# Altium project Fast_Servo.PrjPCB (part 2 of 7)

## Sheet SOM_JB3.SchDoc: SoM TE0720 JB3
size 420 x 297 mm; Author: P. Zdunek; DrawnBy: P. Zdunek; Organization: Altium Limited; Address1: L3, 12a Rodborough Rd; Address2: Frenchs Forest; Address3: NSW; Address4: Australia 2086; DocumentNumber: 5; SheetNumber: 5; SheetTotal: 37; ModifiedBy: -; CheckedDate: -; Title2: Fast Stabilizer; DivGrp: WUT ISE; Designer: G.Kasprowicz
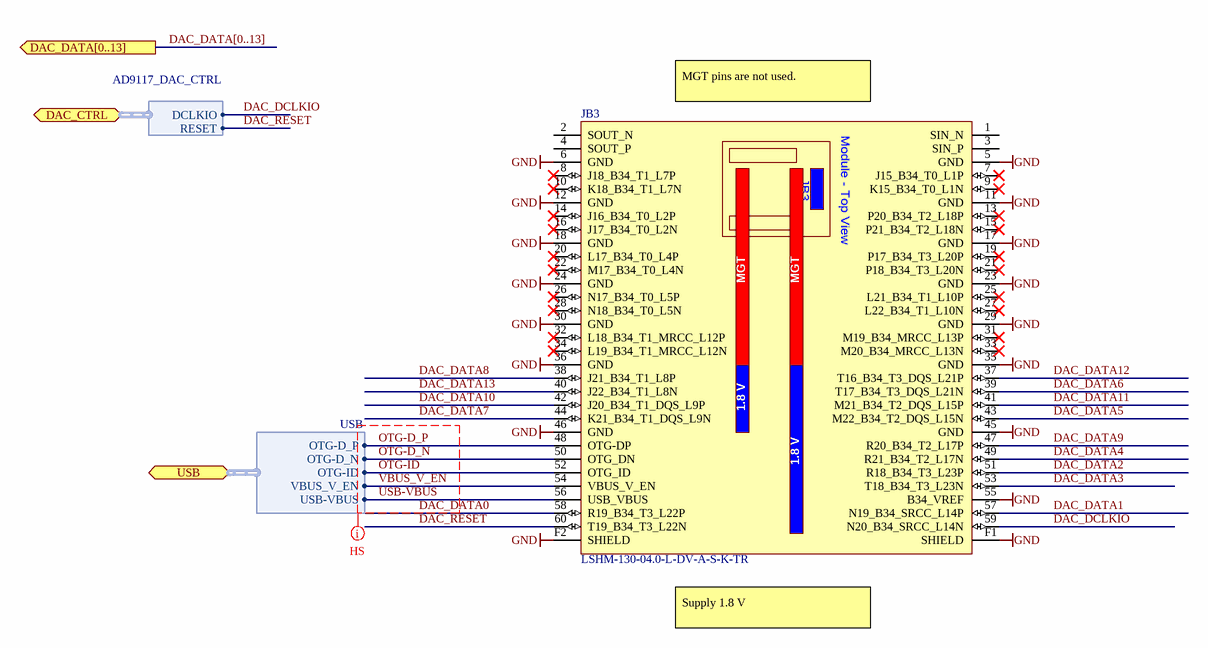
[diagram p4: SOM_JB3.SchDoc]

### Parts
JB3  LSHM-130-04.0-L-DV-A-S-K-TR  [LSHM-130-04.0-x-DV-A-S-K-TR]

### Ports
DAC_CTRL (bidir, harness AD9117_DAC_CTRL), DAC_DATA[0..13] (out), USB (bidir, harness USB)

### Harnesses
USB: USB-VBUS, VBUS_V_EN, OTG-D_P, OTG-D_N, OTG-ID
AD9117_DAC_CTRL: DCLKIO, RESET

### Nets
GND: JB3.5(GND) JB3.6(GND) JB3.11(GND) JB3.12(GND) JB3.17(GND) JB3.18(GND) JB3.23(GND) JB3.24(GND) JB3.29(GND) JB3.30(GND) JB3.35(GND) JB3.36(GND) JB3.45(GND) JB3.46(GND) JB3.55(B34_VREF) JB3.F1(SHIELD) JB3.F2(SHIELD)
DAC_DATA0: JB3.58(R19_B34_T3_L22P)
DAC_DATA1: JB3.57(N19_B34_SRCC_L14P)
DAC_DATA2: JB3.51(R18_B34_T3_L23P)
DAC_DATA3: JB3.53(T18_B34_T3_L23N)
DAC_DATA4: JB3.49(R21_B34_T2_L17N)
DAC_DATA5: JB3.43(M22_B34_T2_DQS_L15N)
DAC_DATA6: JB3.39(T17_B34_T3_DQS_L21N)
DAC_DATA7: JB3.44(K21_B34_T1_DQS_L9N)
DAC_DATA8: JB3.38(J21_B34_T1_L8P)
DAC_DATA9: JB3.47(R20_B34_T2_L17P)
DAC_DATA10: JB3.42(J20_B34_T1_DQS_L9P)
DAC_DATA11: JB3.41(M21_B34_T2_DQS_L15P)
DAC_DATA12: JB3.37(T16_B34_T3_DQS_L21P)
DAC_DATA13: JB3.40(J22_B34_T1_L8N)
DAC_DCLKIO: JB3.59(N20_B34_SRCC_L14N) ; port DAC_CTRL.DCLKIO
DAC_RESET: JB3.60(T19_B34_T3_L22N) ; port DAC_CTRL.RESET
OTG-D_N: JB3.50(OTG_DN) ; port USB.OTG-D_N
OTG-D_P: JB3.48(OTG-DP) ; port USB.OTG-D_P
OTG-ID: JB3.52(OTG_ID) ; port USB.OTG-ID
USB-VBUS: JB3.56(USB_VBUS) ; port USB.USB-VBUS
VBUS_V_EN: JB3.54(VBUS_V_EN) ; port USB.VBUS_V_EN

Not connected (* = marked no-connect by the designer): JB3 1(SIN_N) 2(SOUT_N) 3(SIN_P) 4(SOUT_P) 7(J15_B34_T0_L1P)* 8(J18_B34_T1_L7P)* 9(K15_B34_T0_L1N)* 10(K18_B34_T1_L7N)* 13(P20_B34_T2_L18P)* 14(J16_B34_T0_L2P)* 15(P21_B34_T2_L18N)* 16(J17_B34_T0_L2N)* 19(P17_B34_T3_L20P)* 20(L17_B34_T0_L4P)* 21(P18_B34_T3_L20N)* 22(M17_B34_T0_L4N)* 25(L21_B34_T1_L10P)* 26(N17_B34_T0_L5P)* 27(L22_B34_T1_L10N)* 28(N18_B34_T0_L5N)* 31(M19_B34_MRCC_L13P)* 32(L18_B34_T1_MRCC_L12P)* 33(M20_B34_MRCC_L13N)* 34(L19_B34_T1_MRCC_L12N)*

### Buses and harness runs
bus DAC_DATA[0..13] = port DAC_DATA[0..13]

### Layout directives
net class HIGH_SPEED: DAC_DATA0, OTG-D_N, OTG-D_P, OTG-ID, USB-VBUS, VBUS_V_EN

### Notes on the sheet
- (near JB3) MGT pins are not used.
- (near JB3) MGT
- (near JB3) 1.8 V
- (near JB3) Supply 1.8 V
- Project/Equipment
- Document
- Designer
- Drawn by
- Check.by
- Copyright WUT ISE 2020.
  This documentation describes Open Hardware and is licensed under the CERN OHL v.1.2. You may redistribute and modify this documentation under the terms of the CERN OHL v.1.2. (http://ohwr.org/CERNOHL). This documentation is distributed WITHOUT ANY EXPRESS OR IMPLIED WARRANTY, INCLUDING OF MERCHANTABILITY, SATISFACTORY QUALITY AND FITNESS FOR A PARTICULAR PURPOSE. Please see the CERN OHL v.1.2 for applicable conditions.
- Contact
- File
- Last Mod.
- Print Date
- Sheet
- Size
- A3
- of
- Rev
- (in symbol 25287) Module - Top View

### Library data of the parts
JB3 = 25287: Samtec Razor Beam REF-189017-02, LF-04.0, 60 Pins, für alle 4x5 SoMs; Mixed: SMT; Trenz-Stock: Yes; Trenz-Article-Number: 24903; AN: 25287; Part Number: LSHM-130-04.0-L-DV-A-S-K-TR

## Sheet LEDS.SchDoc: LEDs
size 420 x 297 mm; Author: P. Zdunek; DrawnBy: P. Zdunek; Organization: Altium Limited; Address1: L3, 12a Rodborough Rd; Address2: Frenchs Forest; Address3: NSW; Address4: Australia 2086; DocumentNumber: 15; SheetNumber: 15; SheetTotal: 37; ModifiedBy: -; CheckedDate: -; Title2: Fast Stabilizer; DivGrp: WUT ISE; Designer: G.Kasprowicz
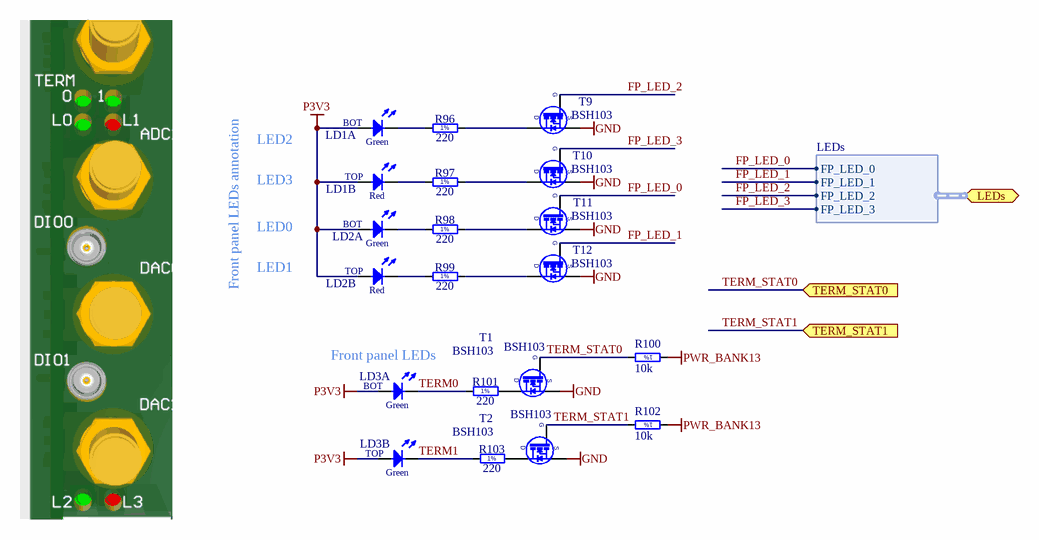
[diagram p5: LEDS.SchDoc]

### Parts
LD1  Red/Green  [LED_DIALIGHT_571-0112F]  (value not drawn)  (parts A,B of 2)
LD2  Red/Green  [LED_DIALIGHT_571-0112F]  (value not drawn)  (parts A,B of 2)
LD3  Green/Green  [LED_DIALIGHT_571-0122F]  (value not drawn)  (parts A,B of 2)
R96  220  [RESC1608X55N]
R97  220  [RESC1608X55N]
R98  220  [RESC1608X55N]
R99  220  [RESC1608X55N]
R100  10k  [RESC1005X40N]
R101  220  [RESC1608X55N]
R102  10k  [RESC1005X40N]
R103  220  [RESC1608X55N]
T1  BSH103  [SOT95P230X110-3N]
T2  BSH103  [SOT95P230X110-3N]
T9  BSH103  [SOT95P230X110-3N]
T10  BSH103  [SOT95P230X110-3N]
T11  BSH103  [SOT95P230X110-3N]
T12  BSH103  [SOT95P230X110-3N]

### Ports
LEDs (bidir, harness LEDs), TERM_STAT0 (in), TERM_STAT1 (in)

### Harnesses
LEDs: FP_LED_0, FP_LED_1, FP_LED_2, FP_LED_3

### Nets
GND: T1.2(S) T2.2(S) T9.2(S) T10.2(S) T11.2(S) T12.2(S)
P3V3: LD1.2(A) LD1.4(A) LD2.2(A) LD2.4(A) LD3.2(A) LD3.4(A)
PWR_BANK13: R100.1 R102.1
FP_LED_0: T11.1(G) ; port LEDs.FP_LED_0
FP_LED_1: T12.1(G) ; port LEDs.FP_LED_1
FP_LED_2: T9.1(G) ; port LEDs.FP_LED_2
FP_LED_3: T10.1(G) ; port LEDs.FP_LED_3
TERM0: LD3.1(C) R101.1
TERM1: LD3.3(C) R103.1
TERM_STAT0: R100.2 T1.1(G) ; port TERM_STAT0
TERM_STAT1: R102.2 T2.1(G) ; port TERM_STAT1
NetLD1_1: LD1.1(C) R96.1
NetLD1_3: LD1.3(C) R97.1
NetLD2_1: LD2.1(C) R98.1
NetLD2_3: LD2.3(C) R99.1
NetR96_2: R96.2 T9.3(D)
NetR97_2: R97.2 T10.3(D)
NetR98_2: R98.2 T11.3(D)
NetR99_2: R99.2 T12.3(D)
NetR101_2: R101.2 T1.3(D)
NetR103_2: R103.2 T2.3(D)

### Notes on the sheet
- LED2
- LED3
- Front panel LEDs annotation
- LED0
- LED1
- Front panel LEDs
- Project/Equipment
- Document
- Designer
- Drawn by
- Check.by
- Copyright WUT ISE 2020.
  This documentation describes Open Hardware and is licensed under the CERN OHL v.1.2. You may redistribute and modify this documentation under the terms of the CERN OHL v.1.2. (http://ohwr.org/CERNOHL). This documentation is distributed WITHOUT ANY EXPRESS OR IMPLIED WARRANTY, INCLUDING OF MERCHANTABILITY, SATISFACTORY QUALITY AND FITNESS FOR A PARTICULAR PURPOSE. Please see the CERN OHL v.1.2 for applicable conditions.
- Contact
- File
- Last Mod.
- Print Date
- Sheet
- Size
- A3
- of
- Rev
- (in symbol LED_DIALIGHT_571-0112F, part A) BOT; Green
- (in symbol LED_DIALIGHT_571-0112F, part B) TOP; Red
- (in symbol LED_DIALIGHT_571-0122F, part A) BOT; Green
- (in symbol LED_DIALIGHT_571-0122F, part B) TOP; Green
- (in symbol R0402_10K_1%_0.0625W_100PPM) 1%
- (in symbol R0603_220R_1%_0.1W_100PPM) 1%

### Library data of the parts
LD1 LD2 = LED_DIALIGHT_571-0112F: 2x LED  Botom Green, Top Red; Part Description: Dual 2mm  LEDs, Red Top,Green Bot, CBI® Circuit Board Indicator (Without positioning pins); PressFit: No; Bonding: No; Part Number: LED_DIALIGHT_571-0112F; Component Kind: Standard; Component Type: Standard; Color: Red/Green; PackageDescription: 2x 2mm LED (Top: Red, Bot: Green) PCB Edge Mounting (Without positioning pins) DIALIGHT 571 Serie; Manufacturer: DIALIGHT; Manufacturer Part Number: 571-0112F; Pin Count: 4; Mounted: Yes; Socket: No; SMD: No; Sense: No; ComponentHeight: 8.6mm; HelpURL: \\cern.ch\dfs\Applications\Altium\Datasheets\LED_DIALIGHT_571-0112F.pdf; Author: CERN DEM JLC; CreateDate: 09/11/2009; LatestRevisionDate: 17/03/2010
LD3 = LED_DIALIGHT_571-0122F: LED x2 Green 1C2A-BOT_3C4A-TOP; Part Description: Dual 2mm Green LEDs CBI® Circuit Board Indicator (Without positioning pins); PressFit: No; Bonding: No; Part Number: LED_DIALIGHT_571-0122F; Component Kind: Standard; Component Type: Standard; Color: Green/Green; PackageDescription: 2x 2mm Red LED PCB Edge Mounting (Without positioning pins) DIALIGHT 571 Serie; Manufacturer: DIALIGHT; Manufacturer Part Number: 571-0122F; Pin Count: 4; Mounted: Yes; Socket: No; SMD: No; Sense: No; ComponentHeight: 8.6mm; HelpURL: \\cern.ch\dfs\Applications\Altium\Datasheets\LED_DIALIGHT_571-0122F.pdf; Author: CERN DEM JLC; CreateDate: 09.11.2009; LatestRevisionDate: 17.03.2010
R96-R99 R101 R103 = R0603_220R_1%_0.1W_100PPM: Resistor - 1%; Part Description: General Purpose Thick Film Chip Resistor; Manufacturer: GENERIC; Manufacturer1 Part Number: NRC06F2200TRF; Power: 0.1W; TC: ±100ppm/°C; Part Number: R0603_220R_1%_0.1W_100PPM; Component Kind: Standard; Component Type: Standard; Pin Count: 2; Value: 220; Status: Preferred; Tolerance: ±1%; Manufacturer Part Number: R0603_220R_1%_0.1W_100PPM; Case: 0603; Mounted: Yes; Sense: No; Socket: No; SMD: Yes; Manufacturer1 Example: NIC COMPONENT; Manufacturer1 ComponentHeight: 0.55mm; HelpURL: \\cern.ch\dfs\Applications\Altium\Datasheets\R0603_NIC_NRC.pdf; Author: CERN DEM JLC; CreateDate: 03.12.2007; LatestRevisionDate: 13.03.2008
R100 R102 = R0402_10K_1%_0.0625W_100PPM: Resistor - 1%; Part Description: General Purpose Thick Film Chip Resistor; Manufacturer: GENERIC; Manufacturer1 Part Number: 232270671003L; TC: ±100ppm/°C; Part Number: R0402_10K_1%_0.0625W_100PPM; Component Kind: Standard; Component Type: Standard; Pin Count: 2; Value: 10k; Status: Not recommended; Power: 0.0625W; Tolerance: ±1%; Manufacturer Part Number: R0402_10K_1%_0.0625W_100PPM; Case: 0402; Mounted: Yes; Sense: No; Socket: No; SMD: Yes; Manufacturer1 Example: YAGEO PHYCOMP; Manufacturer1 ComponentHeight: 0.4mm; HelpURL: \\cern.ch\dfs\Applications\Altium\Datasheets\R0402_Phycomp_RC0402.pdf; Author: CERN DEM JLC; CreateDate: 03.12.2007; LatestRevisionDate: 17.10.2012
T1 T2 T9-T12 = BSH103: N-CHANNEL MOSFET WITH DIODE; Part Description: 30V 850mA N-Channel Enhancement Mode Field-Effect Transistor; Manufacturer: NEXPERIA; PressFit: No; Bonding: No; Part Number: BSH103; Component Kind: Standard; Component Type: Standard; Device: BSH103; Manufacturer Part Number: BSH103; Pin Count: 3; Case: SOT23-3; Mounted: Yes; Socket: No; SMD: Yes; Sense: No; ComponentHeight: 1.1mm; HelpURL: \\cern.ch\dfs\Applications\Altium\Datasheets\BSH103.pdf; Author: CERN DEM JLC; CreateDate: 16.03.2010; LatestRevisionDate: 20.06.2017
  T1 T2: PackageDescription: SOT23, 0.95mm Pitch; 3 Pin, 1.30mm W X 2.90mm L X 1.10mm H body, IPC Medium Density
  T9-T12: PackageDescription: SOT23, 3 pin, Pitch 0.95mm - 1.3mm W X 2.9mm L X 1.1mm H, IPC Medium Density; ClassName: Artix

## Sheet ADC.SchDoc: ADC
size 420 x 297 mm; Author: P. Zdunek; DrawnBy: P. Zdunek; DocumentNumber: 8; SheetNumber: 8; SheetTotal: 37; PageSetup: Record=PageOptions|CenterHorizontal=True|CenterVertical=True|PrintScale=0.82|XCorrection=1.00|YCorrection=1.00|PrintKind=2|BorderSize=5000000|LeftOffset=0|BottomOffset=0|Orientation=2|PaperLength=1000|PaperWidth=1000|Scale=100|PaperSource=15|PrintQuality=600|MediaType=1|DitherType=10|PaperKind=Letter|PrintScaleMode=1; ModifiedBy: -; CheckedDate: -; Title2: Fast Stabilizer; DivGrp: WUT ISE; Designer: G.Kasprowicz
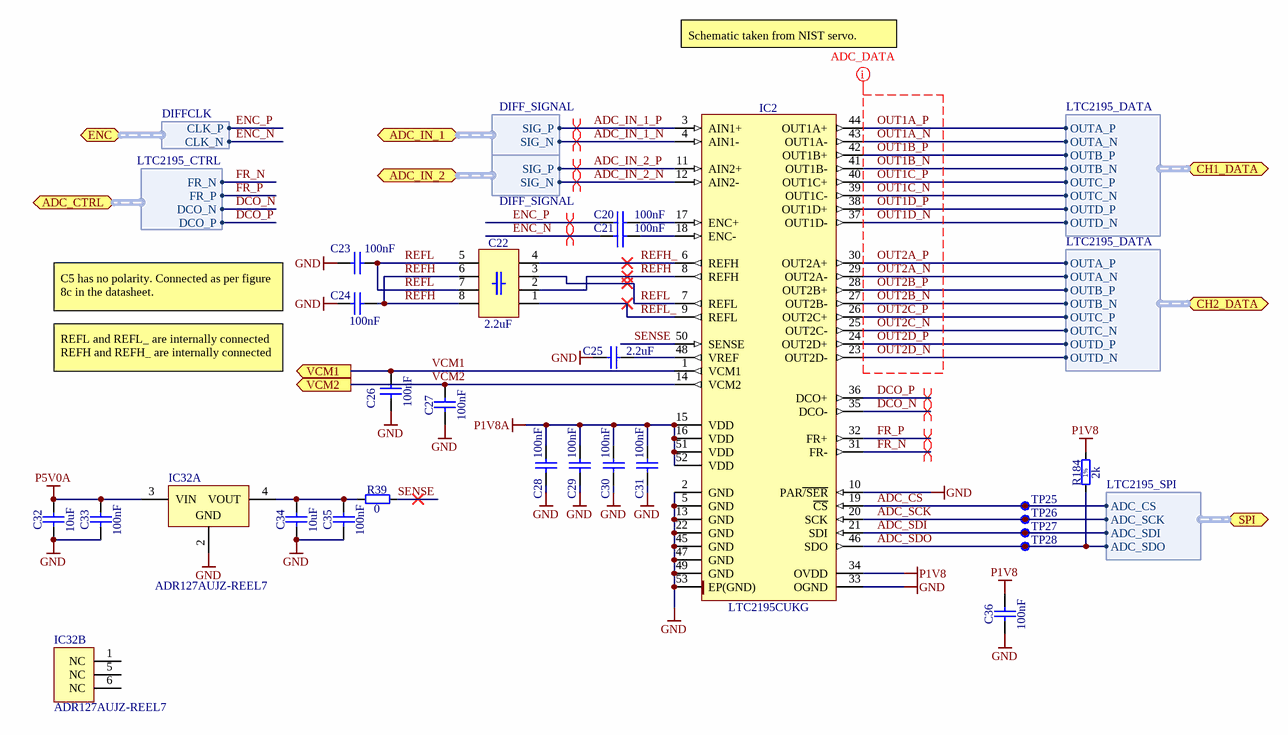
[diagram p6: ADC.SchDoc]

### Parts
C20  100nF  [CAPC1005X55N]
C21  100nF  [CAPC1005X55N]
C22  2.2uF  [CAPCAF50P125X200X95-8N]
C23  100nF  [CAPC1005X55N]
C24  100nF  [CAPC1005X55N]
C25  2.2uF  [CAPC2012X140N]
C26  100nF  [CAPC1005X55N]
C27  100nF  [CAPC1005X55N]
C28  100nF  [CAPC1005X55N]
C29  100nF  [CAPC1005X55N]
C30  100nF  [CAPC1005X55N]
C31  100nF  [CAPC1005X55N]
C32  10uF  [CAPC1608X80N]
C33  100nF  [CAPC1005X55N]
C34  10uF  [CAPC1608X80N]
C35  100nF  [CAPC1005X55N]
C36  100nF  [CAPC1005X55N]
IC2  LTC2195CUKG  [QFN50P700X800X80-53N-R655X550]
IC32  ADR127AUJZ-REEL7  [ADI-UJ-6_M]  (parts A,B of 2)
R39  0  [RESC1005X40N]
R184  2k  [RESC1005X40N]
TP25  SMD Pad  [C100]  (value not drawn)  (no BOM)
TP26  SMD Pad  [C100]  (value not drawn)  (no BOM)
TP27  SMD Pad  [C100]  (value not drawn)  (no BOM)
TP28  SMD Pad  [C100]  (value not drawn)  (no BOM)

### Ports
ADC_CTRL (bidir, harness LTC2195_CTRL), ADC_IN_1 (bidir, harness DIFF_SIGNAL), ADC_IN_2 (bidir, harness DIFF_SIGNAL), CH1_DATA (bidir, harness LTC2195_DATA), CH2_DATA (bidir, harness LTC2195_DATA), ENC (bidir, harness DIFFCLK), SPI (bidir, harness LTC2195_SPI), VCM1 (out), VCM2 (out)

### Harnesses
LTC2195_DATA: OUTD_N, OUTD_P, OUTC_N, OUTC_P, OUTB_N, OUTB_P, OUTA_N, OUTA_P
LTC2195_SPI: ADC_CS, ADC_SCK, ADC_SDI, ADC_SDO
DIFF_SIGNAL: SIG_N, SIG_P
LTC2195_CTRL: FR_N, FR_P, DCO_N, DCO_P
DIFFCLK: CLK_P, CLK_N

### Nets
GND: C23.2 C24.2 C25.1 C26.1 C27.1 C28.2 C29.2 C30.2 C31.2 C32.1 C33.1 C34.1 C35.1 C36.1 IC2.2(GND) IC2.5(GND) IC2.10(PAR~{/SER}) IC2.13(GND) IC2.22(GND) IC2.33(OGND) IC2.45(GND) IC2.47(GND) IC2.49(GND) IC2.53(EP(GND)) IC32.2(GND)
P1V8: C36.2 IC2.34(OVDD) R184.2
P1V8A: C28.1 C29.1 C30.1 C31.1 IC2.15(VDD) IC2.16(VDD) IC2.51(VDD) IC2.52(VDD)
P5V0A: C32.2 C33.2 IC32.3(VIN)
ADC_CS: IC2.19(~{CS}) TP25.1 ; port SPI.ADC_CS
ADC_IN_1_N: IC2.4(AIN1-) ; port ADC_IN_1.SIG_N  [project net ADC_CH2.SIG_N]
ADC_IN_1_P: IC2.3(AIN1+) ; port ADC_IN_1.SIG_P  [project net ADC_CH2.SIG_P]
ADC_IN_2_N: IC2.12(AIN2-) ; port ADC_IN_2.SIG_N  [project net ADC_CH1.SIG_N]
ADC_IN_2_P: IC2.11(AIN2+) ; port ADC_IN_2.SIG_P  [project net ADC_CH1.SIG_P]
ADC_SCK: IC2.20(SCK) TP26.1 ; port SPI.ADC_SCK
ADC_SDI: IC2.21(SDI) TP27.1 ; port SPI.ADC_SDI
ADC_SDO: IC2.46(SDO) R184.1 TP28.1 ; port SPI.ADC_SDO
DCO_N: IC2.35(DCO-) ; port ADC_CTRL.DCO_N  [project net ADC_CTRL.DCO_N]
DCO_P: IC2.36(DCO+) ; port ADC_CTRL.DCO_P  [project net ADC_CTRL.DCO_P]
ENC_N: C21.2 ; port ENC.CLK_N
ENC_P: C20.2 ; port ENC.CLK_P
FR_N: IC2.31(FR-) ; port ADC_CTRL.FR_N  [project net ADC_CTRL.FR_N]
FR_P: IC2.32(FR+) ; port ADC_CTRL.FR_P  [project net ADC_CTRL.FR_P]
OUT1A_N: IC2.43(OUT1A-) ; port CH1_DATA.OUTA_N
OUT1A_P: IC2.44(OUT1A+) ; port CH1_DATA.OUTA_P
OUT1B_N: IC2.41(OUT1B-) ; port CH1_DATA.OUTB_N
OUT1B_P: IC2.42(OUT1B+) ; port CH1_DATA.OUTB_P
OUT1C_N: IC2.39(OUT1C-) ; port CH1_DATA.OUTC_N
OUT1C_P: IC2.40(OUT1C+) ; port CH1_DATA.OUTC_P
OUT1D_N: IC2.37(OUT1D-) ; port CH1_DATA.OUTD_N
OUT1D_P: IC2.38(OUT1D+) ; port CH1_DATA.OUTD_P
OUT2A_N: IC2.29(OUT2A-) ; port CH2_DATA.OUTA_N
OUT2A_P: IC2.30(OUT2A+) ; port CH2_DATA.OUTA_P
OUT2B_N: IC2.27(OUT2B-) ; port CH2_DATA.OUTB_N
OUT2B_P: IC2.28(OUT2B+) ; port CH2_DATA.OUTB_P
OUT2C_N: IC2.25(OUT2C-) ; port CH2_DATA.OUTC_N
OUT2C_P: IC2.26(OUT2C+) ; port CH2_DATA.OUTC_P
OUT2D_N: IC2.23(OUT2D-) ; port CH2_DATA.OUTD_N
OUT2D_P: IC2.24(OUT2D+) ; port CH2_DATA.OUTD_P
REFH: C22.2 C22.6 C22.8 C24.1 IC2.8(REFH)
REFH_: C22.4 IC2.6(REFH)
REFL: C22.3 C22.5 C22.7 C23.1 IC2.7(REFL)
REFL_: C22.1 IC2.9(REFL)
SENSE: IC2.50(SENSE) R39.2
VCM1: C26.2 IC2.1(VCM1) ; port VCM1
VCM2: C27.2 IC2.14(VCM2) ; port VCM2
NetC20_1: C20.1 IC2.17(ENC+)
NetC21_1: C21.1 IC2.18(ENC-)
NetC25_2: C25.2 IC2.48(VREF)
NetC34_2: C34.2 C35.2 IC32.4(VOUT) R39.1

Not connected (* = marked no-connect by the designer): IC32 1(NC) 5(NC) 6(NC)

### Layout directives
differential pair: ADC_CH1.SIG_N, ADC_CH1.SIG_P, ADC_CH2.SIG_N, ADC_CH2.SIG_P, ADC_CTRL.DCO_N, ADC_CTRL.DCO_P, ADC_CTRL.FR_N, ADC_CTRL.FR_P, ENC_N, ENC_P
mark named ADC_DATA: OUT1A_N, OUT1A_P, OUT1B_N, OUT1B_P, OUT1C_N, OUT1C_P, OUT1D_N, OUT1D_P, OUT2A_N, OUT2A_P, OUT2B_N, OUT2B_P, OUT2C_N, OUT2C_P, OUT2D_N, OUT2D_P

### Notes on the sheet
- Schematic taken from NIST servo.
- C5 has no polarity. Connected as per figure 8c in the datasheet.
- REFL and REFL_ are internally connected
  REFH and REFH_ are internally connected
- Project/Equipment
- Document
- Designer
- Drawn by
- Check.by
- Copyright WUT ISE 2020.
  This documentation describes Open Hardware and is licensed under the CERN OHL v.1.2. You may redistribute and modify this documentation under the terms of the CERN OHL v.1.2. (http://ohwr.org/CERNOHL). This documentation is distributed WITHOUT ANY EXPRESS OR IMPLIED WARRANTY, INCLUDING OF MERCHANTABILITY, SATISFACTORY QUALITY AND FITNESS FOR A PARTICULAR PURPOSE. Please see the CERN OHL v.1.2 for applicable conditions.
- Contact
- File
- Last Mod.
- Print Date
- Sheet
- Size
- A3
- of
- Rev
- (in symbol R0402_2K_1%_0.0625W_100PPM) 1%

### Library data of the parts
C20 C21 C23 C24 C26-C31 C33 C35 C36 = CC0402_100NF_16V_10%_X5R: Non-polarised capacitor; Part Description: SMD Multilayer Chip Ceramic Capacitor; Manufacturer: GENERIC; Manufacturer1 Part Number: GRM155R61C104KA88D; Voltage: 16V; TC: X5R; Tolerance: ±10%; Part Number: CC0402_100NF_16V_10%_X5R; Component Kind: Standard; Component Type: Standard; Pin Count: 2; Value: 100nF; Status: None; Manufacturer Part Number: CC0402_100NF_16V_10%_X5R; Case: 0402; Mounted: Yes; Socket: No; SMD: Yes; Sense: No; Manufacturer1 Example: MURATA; Manufacturer1 ComponentHeight: 0.55mm; HelpURL: \\cern.ch\dfs\Applications\Altium\Datasheets\CC0402_X5R_MURATA_GRM.pdf; Author: CERN DEM JLC; CreateDate: 10.12.2013; LatestRevisionDate: 10.12.2013
C22 = CC0508_2.2UF_4V_20%_X7S_MURATA_LLA219C70G225M: 8 Terminals Low ESL Chip Multilayer Ceramic Capacitors for General Purpose; Manufacturer: MURATA; Manufacturer Part Number: LLA219C70G225MA01L; Voltage: 4V; TC: X7S; Tolerance: ±20%; Part Number: CC0508_2.2UF_4V_20%_X7S_MURATA_LLA219C70G225M; Component Kind: Standard; Component Type: Standard; Pin Count: 8; Value: 2.2uF; Status: None; Part Description: 8 Terminals Low ESL Chip Multilayer Ceramic Capacitors for General Purpose; Case: 0508; Mounted: Yes; Socket: No; SMD: Yes; Sense: No; ComponentHeight: 0.95mm; HelpURL: \\cern.ch\dfs\Applications\Altium\Datasheets\CC0508_X7S_MURATA_LLA219C70G225M.pdf; Author: CERN DEM BC; CreateDate: 07/07/2020; LatestRevisionDate: 07/07/2020
C25 = CC0805_2.2UF_50V_10%_X7R: Non-polarised capacitor; Part Description: SMD Multilayer Chip Ceramic Capacitor; Manufacturer: GENERIC; Manufacturer1 Part Number: GRM21BR61H225KA73L; Voltage: 50V; TC: X7R; Tolerance: ±10%; Part Number: CC0805_2.2UF_50V_10%_X7R; Component Kind: Standard; Component Type: Standard; Pin Count: 2; Value: 2.2uF; Status: Preferred; Manufacturer Part Number: CC0805_2.2UF_50V_10%_X7R; Case: 0805; Mounted: Yes; Socket: No; SMD: Yes; Sense: No; Manufacturer1 Example: MURATA; Manufacturer1 ComponentHeight: 1.40mm; HelpURL: \\cern.ch\dfs\Applications\Altium\Datasheets\CC0805_X7R_MURATA_GRM.pdf; Author: CERN DEM JLC; CreateDate: 18/08/2014; LatestRevisionDate: 18/08/2014
C32 C34 = CC0603_10UF_10V_10%_X5R: Non-polarised capacitor; Part Description: SMD Multilayer Chip Ceramic Capacitor; Manufacturer: GENERIC; Manufacturer1 Part Number: GRM188R61A106KE69D; Voltage: 10V; TC: X5R; Tolerance: ±10%; Part Number: CC0603_10UF_10V_10%_X5R; Component Kind: Standard; Component Type: Standard; Pin Count: 2; Value: 10uF; Status: None; Manufacturer Part Number: CC0603_10UF_10V_10%_X5R; Case: 0603; Mounted: Yes; Socket: No; SMD: Yes; Sense: No; Manufacturer1 Example: MURATA; Manufacturer1 ComponentHeight: 0.8mm; HelpURL: \\cern.ch\dfs\Applications\Altium\Datasheets\CC0603_MURATA_GRM188R61A106KE69D.pdf; Author: CERN DEM JLC; CreateDate: 31/01/2017; LatestRevisionDate: 31/01/2017
IC2 = LTC2195CUKG: 16-Bit, 125Msps Low Power Dual ADCs; Manufacturer: ANALOG DEVICES; PressFit: No; Bonding: No; Part Number: LTC2195CUKG; Component Kind: Standard; Component Type: Standard; Device: LTC2195CUKG; PackageDescription: QFN, 0.50mm Pitch, Rect.; 12 pin X 14 Pin, 7.00mm L X 8.00mm W X 0.80mm H body (w/Thermal Tab 6.55 X 5.50mm), IPC Medium Density; Part Description: 16-Bit, 125Msps Low Power Dual ADCs; Manufacturer Part Number: LTC2195CUKG; Pin Count: 53; Case: QFN52; Mounted: Yes; Socket: No; SMD: Yes; Sense: No; ComponentHeight: 0.8mm; Author: CERN DEM BC; HelpURL: \\cern.ch\dfs\Applications\Altium\Datasheets\LTC2195CUKG.pdf; CreateDate: 06/07/2020; LatestRevisionDate: 06/07/2020
IC32 = CMP-0784-00538-1: Precision, Micropower LDO Voltage Reference in TSOT, 1.25 V Output, 2.7 to 18 V Supply, Industrial, 6-pin SOT23 (UJ-6), Reel; Manufacturer: Analog Devices; Max V Supply (V): 18; Vout: 1.25V; Min V Supply (V): 2.7; Ref Out TC (ppm/C): 15; ComponentLink4Description: URL Link1; DatasheetVersion: Rev. B; PackageDescription: 6-Pin Thin Small Outline Transistor Package, Body 2.9 x 1.6 mm, Pitch 0.95 mm; PackageReference: UJ-6; PackageVersion: Dec-04; ComponentLink2Description: Datasheet; ComponentLink1URL: http://www.analog.com/en/index.html; ComponentLink3URL: http://www.analog.com/static/imported-files/packages/PKG_PDF/TSOT(UJ)/UJ_6.pdf; Operating Temp Range: -40 to 125 degC; ComponentLink3Description: Package Specification; Mounting Technology: Surface Mount; ComponentLink1Description: Manufacturer URL; Packing: Reel; PartNumber: ADR127AUJZ-REEL7; ComponentLink2URL: http://www.analog.com/static/imported-files/data_sheets/ADR121_125_127.pdf; ComponentLink4URL: Product URL:http://www.analog.com/en/special-linear-functions/voltage-references/adr127/products/product.html; Code_JEDEC: MO-193-AA
R39 = R0402_0R_JUMPER: as R116 on sheet TOP; Part Number: R0402_0R_JUMPER; Component Kind: Standard; Component Type: Standard; Pin Count: 2; Value: 0; Status: Not Recommended; Manufacturer Part Number: R0402_0R_JUMPER; Case: 0402; Mounted: Yes; Sense: No; Socket: No; SMD: Yes; Manufacturer1 Example: YAGEO PHYCOMP; Manufacturer1 ComponentHeight: 0.4mm; HelpURL: \\cern.ch\dfs\Applications\Altium\Datasheets\R0402_Phycomp_RC0402.pdf; Author: CERN DEM JLC; CreateDate: 03/12/2007; LatestRevisionDate: 17/10/2012
R184 = R0402_2K_1%_0.0625W_100PPM: Resistor - 1%; Part Description: General Purpose Thick Film Chip Resistor; Manufacturer: GENERIC; Manufacturer1 Part Number: 232270672002L; PressFit: No; TC: ±100ppm/°C; Part Number: R0402_2K_1%_0.0625W_100PPM; Component Kind: Standard; Component Type: Standard; Pin Count: 2; Value: 2k; Status: Not Recommended; Manufacturer Part Number: R0402_2K_1%_0.0625W_100PPM; Case: 0402; Mounted: Yes; Sense: No; Socket: No; SMD: Yes; Manufacturer1 Example: YAGEO PHYCOMP; Manufacturer1 ComponentHeight: 0.4mm; HelpURL: \\cern.ch\dfs\Applications\Altium\Datasheets\R0402_Phycomp_RC0402.pdf; Author: CERN DEM JLC; CreateDate: 03/12/2007; LatestRevisionDate: 17/10/2012; Power: 0.0625W; Tolerance: ±1%
TP25-TP28 = SMD_PAD_D1MM: Through Hole Pad; Part Description: 1mm Diameter SMD Pad; Mounted: No; Part Number: SMD_PAD_D1MM; Component Type: Standard (No BOM); Pin Count: 1; Family: SMD Pad; Socket: No; SMD: Yes; Sense: No; Status: None; ComponentHeight: 0mm; HelpURL: Undefined; Author: CERN DEM JLC; CreateDate: 10/10/2017; LatestRevisionDate: 10/10/2017; PackageDescription: 1mm Diameter SMD Pad

## Sheet ADC_AFE.SchDoc: ADC AFE
size 420 x 297 mm; Author: P. Zdunek; DrawnBy: P. Zdunek; Organization: Altium Limited; Address1: L3, 12a Rodborough Rd; Address2: Frenchs Forest; Address3: NSW; Address4: Australia 2086; DocumentNumber: 9; SheetNumber: 9; SheetTotal: 37; ModifiedBy: -; CheckedDate: -; Title2: Fast Stabilizer; DivGrp: WUT ISE; Designer: G.Kasprowicz
Used 2 times, as channels Channel 2, Channel 1. Parts and nets are listed once, with the designators drawn on the sheet.
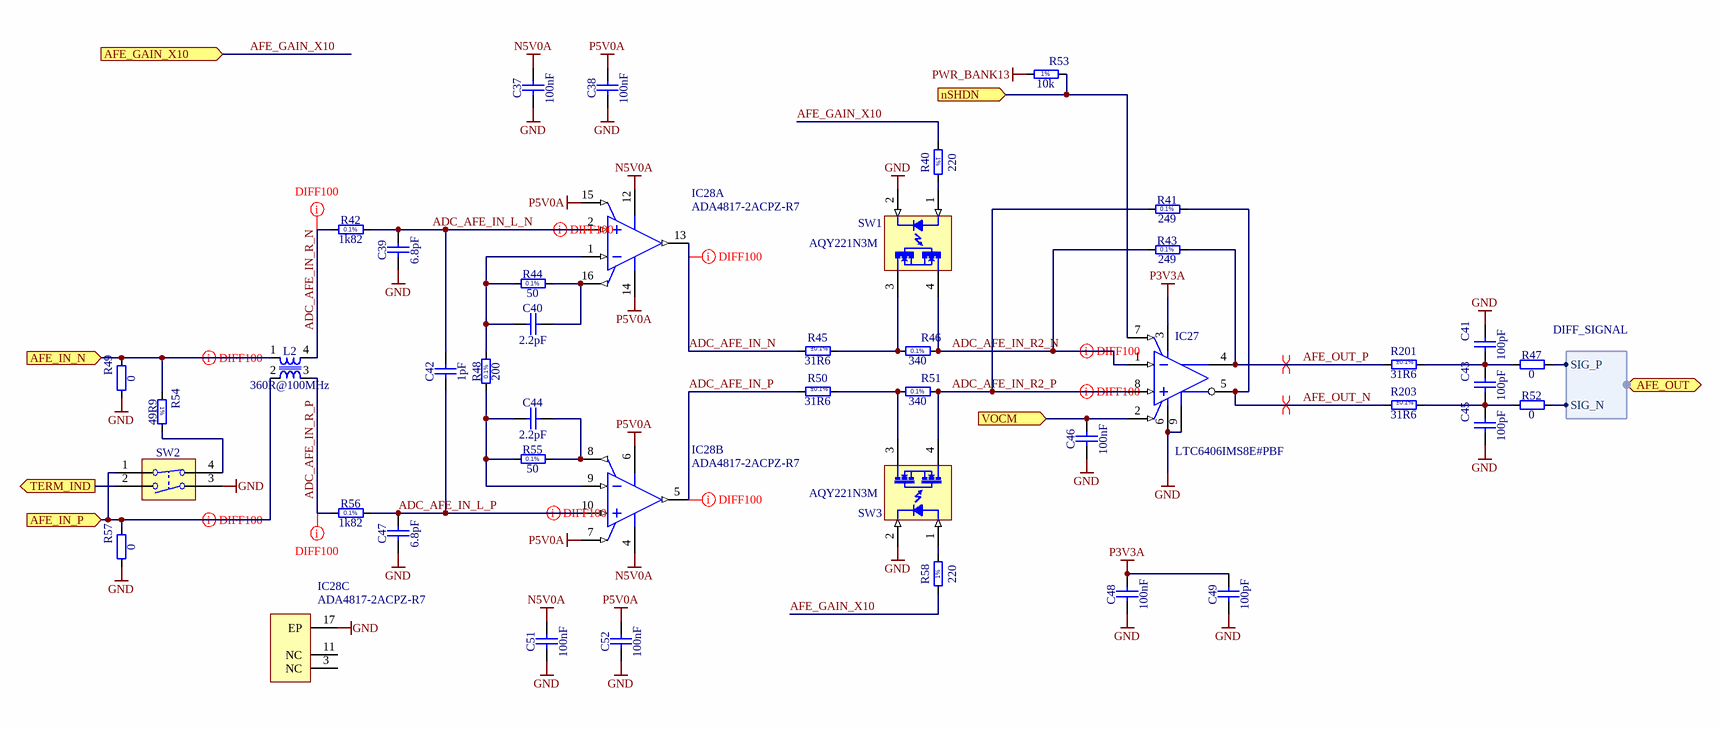
[diagram p7: ADC_AFE.SchDoc]

### Parts
C37  100nF  [CAPC1005X55N]
C38  100nF  [CAPC1005X55N]
C39  6.8pF  [CAPC1005X61N]
C40  2.2pF  [CAPC1608X87N]
C41  100pF  [CAPC1005X55N]
C42  1pF  [CAPC1005X55N]
C43  100pF  [CAPC1005X55N]
C44  2.2pF  [CAPC1608X87N]
C45  100pF  [CAPC1005X55N]
C46  100nF  [CAPC1005X55N]
C47  6.8pF  [CAPC1005X61N]
C48  100nF  [CAPC1005X55N]
C49  100pF  [CAPC1005X55N]
C51  100nF  [CAPC1005X55N]
C52  100nF  [CAPC1005X55N]
IC27  LTC6406IMS8E#PBF  [LT-MS8E-8-EDP_M]
IC28  ADA4817-2ACPZ-R7  [CP-16-4_N]  (parts A,B,C of 3)
L2  360R@100MHz  [IND_TDK_ACM2012]
R40  220  [RESC1608X55N]
R41  249  [RESC1608X55N]
R42  1k82  [RESC1608X55N]
R43  249  [RESC1608X55N]
R44  50  [RESC1005X35N]
R45  31R6  Tolerance: ±0.1%  [RESC1608X55N]
R46  340  [RESC1608X55N]
R47  0  [RESC1005X40N]
R48  200  [RESC1608X55N]
R49  0  [RESC1005X40N]
R50  31R6  Tolerance: ±0.1%  [RESC1608X55N]
R51  340  [RESC1608X55N]
R52  0  [RESC1005X40N]
R53  10k  [RESC1005X40N]
R54  49R9  [RESC6331X70N]
R55  50  [RESC1005X35N]
R56  1k82  [RESC1608X55N]
R57  0  [RESC1005X40N]
R58  220  [RESC1608X55N]
R201  31R6  Tolerance: ±0.1%  [RESC1608X55N]
R203  31R6  Tolerance: ±0.1%  [RESC1608X55N]
SW1  AQY221N3M  [PANASONIC_AQY22(SON)]
SW2  Switch  [SW_CTS_204-121ST]  (value not drawn)
SW3  AQY221N3M  [PANASONIC_AQY22(SON)]

### Ports
AFE_GAIN_X10 (in), AFE_IN_N (in), AFE_IN_P (in), AFE_OUT (bidir, harness DIFF_SIGNAL), nSHDN (in), TERM_IND (out), VOCM (in)

### Harnesses
DIFF_SIGNAL: SIG_P, SIG_N

### Nets
GND: C37.1 C38.1 C39.1 C41.2 C45.1 C46.1 C47.1 C48.1 C49.1 C51.1 C52.1 IC27.6(V-) IC27.9(EP) IC28.17(EP) R49.1 R57.1 SW1.2(K) SW2.3 SW3.2(K)
N5V0A: C37.2 C51.2 IC28.4(-VS_2) IC28.12(-VS_1)
P3V3A: C48.2 C49.2 IC27.3(V+)
P5V0A: C38.2 C52.2 IC28.6(+VS_2) IC28.7(~{PD2}) IC28.14(+VS_1) IC28.15(~{PD1})
PWR_BANK13: R53.1
ADC_AFE_IN_L_N: C39.2 C42.2 IC28.2(+IN_1) R42.2
ADC_AFE_IN_L_P: C42.1 C47.2 IC28.10(+IN_2) R56.2
ADC_AFE_IN_N: IC28.13(OUT_1) R45.1
ADC_AFE_IN_P: IC28.5(OUT_2) R50.1
ADC_AFE_IN_R2_N: IC27.1(-IN) R43.1 R46.2 SW1.4(E)
ADC_AFE_IN_R2_P: IC27.8(+IN) R41.1 R51.2 SW3.4(E)
ADC_AFE_IN_R_N: L2.4 R42.1
ADC_AFE_IN_R_P: L2.3 R56.1
AFE_GAIN_X10: R40.1 R58.1 ; port AFE_GAIN_X10
AFE_IN_N: L2.1 R49.2 R54.1 ; port AFE_IN_N
AFE_IN_P: L2.2 R57.2 SW2.1 ; port AFE_IN_P
AFE_OUT_N: IC27.5(-OUT) R41.2 R203.1
AFE_OUT_P: IC27.4(+OUT) R43.2 R201.1
nSHDN: IC27.7(~{SHDN}) R53.2 ; port nSHDN
TERM_IND: SW2.2 ; port TERM_IND
VOCM: C46.2 IC27.2(VOCM) ; port VOCM
NetC40_1: C40.1 IC28.1(-IN_1) R44.1 R48.2
NetC40_2: C40.2 IC28.16(FB1) R44.2
NetC41_1: C41.1 C43.2 R47.1 R201.2
NetC43_1: C43.1 C45.2 R52.1 R203.2
NetC44_1: C44.1 IC28.9(-IN_2) R48.1 R55.1
NetC44_2: C44.2 IC28.8(FB2) R55.2
NetR40_2: R40.2 SW1.1(A)
NetR45_2: R45.2 R46.1 SW1.3(C)
NetR47_2: R47.2 ; port AFE_OUT.SIG_P
NetR50_2: R50.2 R51.1 SW3.3(C)
NetR52_2: R52.2 ; port AFE_OUT.SIG_N
NetR54_2: R54.2 SW2.4
NetR58_2: R58.2 SW3.1(A)

Not connected (* = marked no-connect by the designer): IC28 3(NC) 11(NC)

### Channels
Channel 2: designators end in A; ports AFE_GAIN_X10=AFE_GAIN_X10 AFE_IN_N=ADC_1_N AFE_IN_P=ADC_1_P nSHDN=ADC_AFE_CH2_nSHDN TERM_IND=TERM_STAT1 VOCM=VCM1
Channel 1: designators end in B; ports AFE_GAIN_X10=AFE_GAIN_X10 AFE_IN_N=ADC_0_N AFE_IN_P=ADC_0_P nSHDN=ADC_AFE_CH1_nSHDN TERM_IND=TERM_STAT0 VOCM=VCM2

### Layout directives
differential pair: ADC_1_N, ADC_1_P, ADC_AFE_IN_L_N_Channel 2, ADC_AFE_IN_L_P_Channel 2, ADC_AFE_IN_N_Channel 2, ADC_AFE_IN_P_Channel 2, ADC_AFE_IN_R2_N_Channel 2, ADC_AFE_IN_R2_P_Channel 2, ADC_AFE_IN_R_N_Channel 2, ADC_AFE_IN_R_P_Channel 2, AFE_OUT_N_Channel 2, AFE_OUT_P_Channel 2

### Notes on the sheet
- Project/Equipment
- Document
- Designer
- Drawn by
- Check.by
- Copyright WUT ISE 2020.
  This documentation describes Open Hardware and is licensed under the CERN OHL v.1.2. You may redistribute and modify this documentation under the terms of the CERN OHL v.1.2. (http://ohwr.org/CERNOHL). This documentation is distributed WITHOUT ANY EXPRESS OR IMPLIED WARRANTY, INCLUDING OF MERCHANTABILITY, SATISFACTORY QUALITY AND FITNESS FOR A PARTICULAR PURPOSE. Please see the CERN OHL v.1.2 for applicable conditions.
- Contact
- File
- Last Mod.
- Print Date
- Sheet
- Size
- A3
- of
- Rev
- (in symbol R0402_10K_1%_0.0625W_100PPM) 1%
- (in symbol R0402_50R_0.1%_0.05W_25PPM) 0.1%
- (in symbol R0603_1K82_0.1%_0.063W_10PPM) 0.1%
- (in symbol R0603_200R_0.1%_0.063W_10PPM) 0.1%
- (in symbol R0603_220R_1%_0.1W_100PPM) 1%
- (in symbol R0603_249R_0.1%_0.063W_10PPM) 0.1%
- (in symbol R0603_340R_0.1%_0.063W_10PPM) 0.1%
- (in symbol R2512_49R9_1%_1W_100PPM_VISHAY_CRCW) 1%

### Library data of the parts
C37 C38 C46 C48 C51 C52 = CC0402_100NF_16V_10%_X7R: Non-polarised capacitor; Part Description: SMD Multilayer Chip Ceramic Capacitor; Manufacturer: GENERIC; Manufacturer1 Part Number: GRM155R71C104KA88D; Voltage: 16V; TC: X7R; Tolerance: ±10%; Part Number: CC0402_100NF_16V_10%_X7R; Component Kind: Standard; Component Type: Standard; Pin Count: 2; Value: 100nF; Status: Not Recommended; Manufacturer Part Number: CC0402_100NF_16V_10%_X7R; Case: 0402; Mounted: Yes; Socket: No; SMD: Yes; Sense: No; Manufacturer1 Example: MURATA; Manufacturer1 ComponentHeight: 0.55mm; HelpURL: \\cern.ch\dfs\Applications\Altium\Datasheets\CC0402_X7R_MURATA_GRM.pdf; Author: CERN DEM JLC; CreateDate: 05-Dec-13; LatestRevisionDate: 03-Dec-07
C39 C47 = CC0402_6.8PF_50V_0.1PF_NP0_JOHANSON_R07S: Non-polarised capacitor; Part Description: Ultra High-Q SMD Multilayer Capacitor; Manufacturer: JOHANSON TECHNOLOGY; Manufacturer Part Number: 500R07S6R8BV4T; Voltage: 50V; TC: C0G/NP0; Tolerance: ±0.1pF; Part Number: CC0402_6.8PF_50V_0.1PF_NP0_JOHANSON_R07S; Component Kind: Standard; Component Type: Standard; Pin Count: 2; Value: 6.8pF; Status: Not Recommended; Case: 0402; Mounted: Yes; Socket: No; SMD: Yes; Sense: No; HelpURL: \\cern.ch\dfs\Applications\Altium\Datasheets\CC0402_NP0_JOHANSON_R07S.pdf; Author: CERN DEM BC; CreateDate: 17-Nov-17; LatestRevisionDate: 26-Sep-18; ComponentHeight: 0.61mm
C40 C44 = CC0603_2.2PF_50V_0.25PF_NP0: Non-polarised capacitor; Part Description: SMD Multilayer Chip Ceramic Capacitor; Manufacturer: GENERIC; Manufacturer1 Part Number: 223886715228; Voltage: 50V; TC: C0G/NP0; Tolerance: ±0.25pF; Part Number: CC0603_2.2PF_50V_0.25PF_NP0; Component Kind: Standard; Component Type: Standard; Pin Count: 2; Value: 2.2pF; Status: Preferred; Manufacturer Part Number: CC0603_2.2PF_50V_0.25PF_NP0; Case: 0603; Mounted: Yes; Socket: No; SMD: Yes; Sense: No; Manufacturer1 Example: PHYCOMP; Manufacturer1 ComponentHeight: 0.87mm; HelpURL: \\cern.ch\dfs\Applications\Altium\Datasheets\CC0603_NP0_PHYCOMP.pdf; Author: CERN DEM JLC; CreateDate: 03-Dec-07; LatestRevisionDate: 03-Dec-07
C41 C43 C45 C49 = CC0402_100PF_50V_2%_C0G: Non-polarised capacitor; Part Description: SMD Multilayer Chip Ceramic Capacitor; Manufacturer: GENERIC; Manufacturer Part Number: CC0402_100PF_50V_5%_C0G; Manufacturer1 Part Number: C0402C101G5GAC; Voltage: 50V; TC: C0G/NP0; Tolerance: ±2%; Part Number: CC0402_100PF_50V_2%_C0G; Component Kind: Standard; Component Type: Standard; Pin Count: 2; Value: 100pF; Status: Preferred; Case: 0402; Mounted: Yes; Socket: No; SMD: Yes; Sense: No; Manufacturer1 Example: KEMET; Manufacturer1 ComponentHeight: 0.55mm; HelpURL: \\cern.ch\dfs\Applications\Altium\Datasheets\CC0402_C0G_KEMET_(Commercial Grade).pdf; Author: CERN DEM BC; CreateDate: 15.06.2020; LatestRevisionDate: 15.06.2020
C42 = CC0402_1PF_50V_0.25PF_C0G: Non-polarised capacitor; Part Description: SMD Multilayer Chip Ceramic Capacitor; Manufacturer: GENERIC; Manufacturer1 Part Number: C0402C109C5GACTU; Voltage: 50V; TC: C0G/NP0; Tolerance: ±0.25pF; Part Number: CC0402_1PF_50V_0.25PF_C0G; Component Kind: Standard; Component Type: Standard; Pin Count: 2; Value: 1pF; Status: Preferred; Manufacturer Part Number: CC0402_1PF_50V_0.25PF_C0G; Case: 0402; Mounted: Yes; Socket: No; SMD: Yes; Sense: No; Manufacturer1 Example: KEMET; Manufacturer1 ComponentHeight: 0.55mm; HelpURL: \\cern.ch\dfs\Applications\Altium\Datasheets\CC0805_C0G_KEMET_(Commercial Grade).pdf; Author: CERN DEM JLC; CreateDate: 03-Dec-07; LatestRevisionDate: 22-Apr-15
IC27 = CMP-0359-00998-2: Single Channel, Low Noise, Differential Amplifier / Driver, RRI, 3000 MHz Typical GBW, 630 V/us Typical SR, 2.7 to 3.5 V, 8-Pin SOP (MS8E-8), Industrial, Pb-Free; Manufacturer: Linear Technology; GBW (MHz) Typical: 3000; Vs Max (V): 3.5; Vos (mV) Typical: 1; Vs Min (V): 2.7; Is (mA) Typical: 18; SR (V/us) Typical: 630; PackageVersion: Rev J; Linear Technology Part Number: LTC6406; RoHS: Pb-Free; ComponentLink1Description: Manufacturer URL; Type: DIFF; PackageReference: LT-MS8E-8-EDP; PartNumber: LTC6406IMS8E#PBF; DatasheetVersion: Rev. C; Mounting Technology: Surface Mount; ComponentLink1URL: http://www.linear.com/; ComponentLink2URL: http://cds.linear.com/docs/en/datasheet/6406fc.pdf; ComponentLink2Description: Datasheet; RevisionNote: URLs updated; PackageDescription: 8-Lead Plastic MSOP, Body 3.00 x 3.00 mm. Pitch 0.65 mm; Channels (#): 1; ComponentLink3URL: http://cds.linear.com/docs/en/packaging/05081662_J_MS8E.pdf; ComponentLink3Description: Package Specification
IC28 = CMP-0384-02092-2: Double Channel Low Noise Operational Amplifier, 1.05 GHz BW, 870 V/us SR, Industrial, 16-pin QFN (CP-16-4), Reel; Manufacturer: Analog Devices; Input Bias Current: 2pA; V Span Max: 10V; Amplifiers Per Package: 2; Iq/Amp: 21mA; V Span Min: 5V; Input Offset Voltage: 2mV; Small Signal Bandwidth: 1.05GHz; DatasheetVersion: Rev. A; Generic Part Number: ADA4817-2; RevisionNote: Reference Circuit URL fixed; ComponentLink2URL: http://www.analog.com/static/imported-files/data_sheets/ADA4817-1_4817-2.pdf; ComponentLink2Description: Datasheet; ComponentLink1Description: Manufacturer URL; Slew Rate: 870V/us; ComponentLink1URL: http://www.analog.com/en/index.html; ComponentLink3URL: http://www.analog.com/static/imported-files/packages/46009454504174339653421710019CP_16_4.pdf; ComponentLink4URL: http://www.analog.com/en/all-operational-amplifiers-op-amps/operational-amplifiers-op-amps/ada4817-2/products/product.html#product-recommendations; PackageReference: CP-16-4; ComponentLink3Description: Package Specification; PackageDescription: 16-Pin Lead Frame Chip Scale Package, Body 4 x 4 mm, Pitch 0.65 mm; Mounting Technology: Surface Mount; Code_JEDEC: MO-220-VGGC; ComponentLink4Description: Reference Circuit; PartNumber: ADA4817-2ACPZ-R7; PackageVersion: 010606-0
L2 = IND_TDK_ACM2012-361-2P: Inductor Common Mode; Part Description: Common Mode Filters For High-Speed Differential Signal Line, TDK ACM2012 Series; Manufacturer: TDK; Power: 220mA; Resistance: 0R5; Part Number: IND_TDK_ACM2012-361-2P; Component Kind: Standard; Component Type: Standard; Pin Count: 2; Value: 360R@100MHz; Status: None; Manufacturer Part Number: ACM2012-361-2P; Mounted: Yes; Socket: No; SMD: Yes; Sense: No; ComponentHeight: 1.3mm; HelpURL: \\cern.ch\dfs\Applications\Altium\Datasheets\IND_TDK_ACM2012.pdf; Author: CERN DEM BC; CreateDate: 07/07/2020; LatestRevisionDate: 07/07/2020
R40 R58 = R0603_220R_1%_0.1W_100PPM: Resistor - 1%; Manufacturer1 Part Number: NRC06F2200TRF; Manufacturer: GENERIC; Part Description: General Purpose Thick Film Chip Resistor; Power: 0.1W; Table: Resistors SMD; TC: ±100ppm/°C; PressFit: No; Author: CERN DEM JLC; Case: 0603; Component Type: Standard; CreateDate: 03/12/2007; HelpURL: \\cern.ch\dfs\Applications\Altium\Datasheets\R0603_NIC_NRC.pdf; LatestRevisionDate: 13/03/2008; Manufacturer1 ComponentHeight: 0.55mm; Manufacturer1 Example: NIC COMPONENT; Manufacturer Part Number: R0603_220R_1%_0.1W_100PPM; Mounted: Yes; Pin Count: 2; SMD: Yes; Socket: No; Status: Preferred; Tolerance: ±1%; Value: 220; Part Number: R0603_220R_1%_0.1W_100PPM; Component Kind: Standard; Sense: No
R41 R43 = R0603_249R_0.1%_0.063W_10PPM: Resistor - 0.1%; Part Description: Thin Film Chip Resistor; Manufacturer: GENERIC; Manufacturer1 Part Number: RN73C1J249RBTDF; Power: 0.063W; TC: ±10ppm; PressFit: No; Part Number: R0603_249R_0.1%_0.063W_10PPM; Component Kind: Standard; Component Type: Standard; Pin Count: 2; Value: 249; Status: Not Recommended; Tolerance: ±0.1%; Manufacturer Part Number: R0603_249R_0.1%_0.063W_10PPM; Case: 0603; Mounted: Yes; Sense: No; Socket: No; SMD: Yes; Manufacturer1 Example: TYCO HOLSWORTHY; Manufacturer1 ComponentHeight: 0.5mm; HelpURL: \\cern.ch\dfs\Applications\Altium\Datasheets\R0603_Tyco_RN73.pdf; Author: CERN DEM JLC; CreateDate: 03-Dec-07; LatestRevisionDate: 13-Mar-08
R42 R56 = R0603_1K82_0.1%_0.063W_10PPM: Resistor - 0.1%; Part Description: Thin Film Chip Resistor; Manufacturer: GENERIC; Manufacturer1 Part Number: RN73C1J1K82BTDF; Power: 0.063W; TC: ±10ppm; PressFit: No; Part Number: R0603_1K82_0.1%_0.063W_10PPM; Component Kind: Standard; Component Type: Standard; Pin Count: 2; Value: 1k82; Status: Not Recommended; Tolerance: ±0.1%; Manufacturer Part Number: R0603_1K82_0.1%_0.063W_10PPM; Case: 0603; Mounted: Yes; Sense: No; Socket: No; SMD: Yes; Manufacturer1 Example: TYCO HOLSWORTHY; Manufacturer1 ComponentHeight: 0.5mm; HelpURL: \\cern.ch\dfs\Applications\Altium\Datasheets\R0603_Tyco_RN73.pdf; Author: CERN DEM JLC; CreateDate: 03/12/2007; LatestRevisionDate: 13/03/2008
R44 R55 = R0402_50R_0.1%_0.05W_25PPM: Resistor - 0.1%; Part Description: Thin Film Precision Resistor; Manufacturer: GENERIC; Manufacturer1 Part Number: FC0402E50R0BTBS; Power: 0.05W; TC: ±25ppm/°C; PressFit: No; Part Number: R0402_50R_0.1%_0.05W_25PPM; Component Kind: Standard; Component Type: Standard; Pin Count: 2; Value: 50; Status: Not Recommended; Tolerance: ±0.1%; Manufacturer Part Number: R0402_50R_0.1%_0.05W_25PPM; Case: 0402; Mounted: Yes; Sense: No; Socket: No; SMD: Yes; Manufacturer1 Example: VISHAY DALE; Manufacturer1 ComponentHeight: 0.38mm; HelpURL: \\cern.ch\dfs\Applications\Altium\Datasheets\R0402_VISHAY_FC.pdf; Author: CERN DEM JMW; CreateDate: 11-Aug-16; LatestRevisionDate: 11-Aug-16
R45 R50 R201 R203 = R0603_31R6_0.1%_0.063W_10PPM: Resistor - 0.1%; Part Description: Thin Film Chip Resistor; Manufacturer: GENERIC; Manufacturer1 Part Number: RN73C1J31R6BTDF; Power: 0.063W; TC: ±10ppm; PressFit: No; Part Number: R0603_31R6_0.1%_0.063W_10PPM; Component Kind: Standard; Component Type: Standard; Pin Count: 2; Value: 31R6; Status: Not Recommended; Manufacturer Part Number: R0603_31R6_0.1%_0.063W_10PPM; Case: 0603; Mounted: Yes; Sense: No; Socket: No; SMD: Yes; Manufacturer1 Example: TYCO HOLSWORTHY; Manufacturer1 ComponentHeight: 0.5mm; HelpURL: \\cern.ch\dfs\Applications\Altium\Datasheets\R0603_Tyco_RN73.pdf; Author: CERN DEM JLC; CreateDate: 03.12.2007; LatestRevisionDate: 13.03.2008
R46 R51 = R0603_340R_0.1%_0.063W_10PPM: Resistor - 0.1%; Part Description: Thin Film Chip Resistor; Manufacturer: GENERIC; Manufacturer1 Part Number: RN73C1J340RBTDF; Power: 0.063W; TC: ±10ppm; PressFit: No; Part Number: R0603_340R_0.1%_0.063W_10PPM; Component Kind: Standard; Component Type: Standard; Pin Count: 2; Value: 340; Status: Not Recommended; Tolerance: ±0.1%; Manufacturer Part Number: R0603_340R_0.1%_0.063W_10PPM; Case: 0603; Mounted: Yes; Sense: No; Socket: No; SMD: Yes; Manufacturer1 Example: TYCO HOLSWORTHY; Manufacturer1 ComponentHeight: 0.5mm; HelpURL: \\cern.ch\dfs\Applications\Altium\Datasheets\R0603_Tyco_RN73.pdf; Author: CERN DEM JLC; CreateDate: 03/12/2007; LatestRevisionDate: 13/03/2008
R47 R49 R52 R57 = R0402_0R_JUMPER: Resistor; Part Description: 1A (0.05R Max DC Resistance) Zero Ohm Jumper; Manufacturer: GENERIC; Manufacturer1 Part Number: 232270591001L; PressFit: No; Part Number: R0402_0R_JUMPER; Component Kind: Standard; Component Type: Standard; Pin Count: 2; Value: 0; Status: Not Recommended; Manufacturer Part Number: R0402_0R_JUMPER; Case: 0402; Mounted: Yes; Sense: No; Socket: No; SMD: Yes; Manufacturer1 Example: YAGEO PHYCOMP; Manufacturer1 ComponentHeight: 0.4mm; HelpURL: \\cern.ch\dfs\Applications\Altium\Datasheets\R0402_Phycomp_RC0402.pdf; Author: CERN DEM JLC
  R47 R52: CreateDate: 03-Dec-07; LatestRevisionDate: 17-Oct-12
  R49 R57: CreateDate: 03/12/2007; LatestRevisionDate: 17/10/2012
R48 = R0603_200R_0.1%_0.063W_10PPM: Resistor - 0.1%; Part Description: Thin Film Chip Resistor; Manufacturer: GENERIC; Manufacturer1 Part Number: RN73C1J200RBTDF; Power: 0.063W; TC: ±10ppm; PressFit: No; Part Number: R0603_200R_0.1%_0.063W_10PPM; Component Kind: Standard; Component Type: Standard; Pin Count: 2; Value: 200; Status: Not Recommended; Tolerance: ±0.1%; Manufacturer Part Number: R0603_200R_0.1%_0.063W_10PPM; Case: 0603; Mounted: Yes; Sense: No; Socket: No; SMD: Yes; Manufacturer1 Example: TYCO HOLSWORTHY; Manufacturer1 ComponentHeight: 0.5mm; HelpURL: \\cern.ch\dfs\Applications\Altium\Datasheets\R0603_Tyco_RN73.pdf; Author: CERN DEM JLC; CreateDate: 03-Dec-07; LatestRevisionDate: 13-Mar-08
R53 = R0402_10K_1%_0.0625W_100PPM: Resistor - 1%; Part Description: General Purpose Thick Film Chip Resistor; Manufacturer: GENERIC; Manufacturer1 Part Number: 232270671003L; TC: ±100ppm/°C; PressFit: No; Part Number: R0402_10K_1%_0.0625W_100PPM; Component Kind: Standard; Component Type: Standard; Pin Count: 2; Value: 10k; Status: Not Recommended; Power: 0.0625W; Tolerance: ±1%; Manufacturer Part Number: R0402_10K_1%_0.0625W_100PPM; Case: 0402; Mounted: Yes; Sense: No; Socket: No; SMD: Yes; Manufacturer1 Example: YAGEO PHYCOMP; Manufacturer1 ComponentHeight: 0.4mm; HelpURL: \\cern.ch\dfs\Applications\Altium\Datasheets\R0402_Phycomp_RC0402.pdf; Author: CERN DEM JLC; CreateDate: 03.12.2007; LatestRevisionDate: 17.10.2012
R54 = R2512_49R9_1%_1W_100PPM_VISHAY_CRCW: Resistor - 1%; Part Description: Thick Film Chip Resistor; Manufacturer: VISHAY DRALORIC; Manufacturer Part Number: CRCW251249R9FKEG; Power: 1W; TC: ±100ppm/°C; PressFit: No; Part Number: R2512_49R9_1%_1W_100PPM_VISHAY_CRCW; Component Kind: Standard; Component Type: Standard; Pin Count: 2; Value: 49R9; Status: None; Tolerance: ±1%; Case: 2512; Mounted: Yes; Sense: No; Socket: No; SMD: Yes; ComponentHeight: 0.7mm; HelpURL: \\cern.ch\dfs\Applications\Altium\Datasheets\R2512_VISHAY_CRCW2512.pdf; Author: CERN DEM JLC; CreateDate: 22.05.2012; LatestRevisionDate: 22.05.2012
SW1 SW3 = AQY221N3M: PhotoMOS Relay; Part Description: RF SON 1 Form A, PhotoMOS Relay, CxR5 (On Res. 5.5Ohm, Out Cap. 1.1pF), 25V 150mA; Manufacturer: PANASONIC; Table: Optocouplers; Bonding: No; PressFit: No; Part Number: AQY221N3M; Component Kind: Standard; Component Type: Standard; Device: AQY221N3M; PackageDescription: PANASONIC Serie AQY22(SON)  Small Outline No Lead, 4 pins, 2.2x2.95mm; Manufacturer Part Number: AQY221N3M; Pin Count: 4; Case: SON4; Mounted: Yes; Socket: No; SMD: Yes; ComponentHeight: 1.4mm; HelpURL: \\cern.ch\dfs\Applications\Altium\Datasheets\AQY221N3M.pdf; ComponentLink1Description: Package Drawing; ComponentLink1URL: \\cern.ch\dfs\Applications\Altium\Datasheets\AQY221N3M_Package-Drawing.pdf; Author: CERN DEM JLC; CreateDate: 18/01/2010; LatestRevisionDate: 05/12/2018; Sense: No
SW2 = SW_CTS_204-121ST: 2x SPST DIP Switch 1NO + 1NF; Part Description: Coupled SPST DIP Switch, 1NO + 1NF, CTS 204 Series; Manufacturer: CTS; PressFit: No; Part Number: SW_CTS_204-121ST; Component Kind: Standard; Component Type: Standard; Pin Count: 4; PackageDescription: Body 7.26 x 9.78mm, 2x SPST DIP, 1NO + 1NF Switch, CTS 204 Series; Family: Switch; Mounted: Yes; Socket: No; SMD: Yes; Sense: No; Status: None; Manufacturer Part Number: 204-121ST; ComponentHeight: 10.36mm; HelpURL: \\cern.ch\dfs\Applications\Altium\Datasheets\SW_CTS_204-121ST.pdf; Author: CERN DEM JLC; CreateDate: 28.08.2014; LatestRevisionDate: 28.08.2014